# Altium project MainPCBV6.PrjPcb
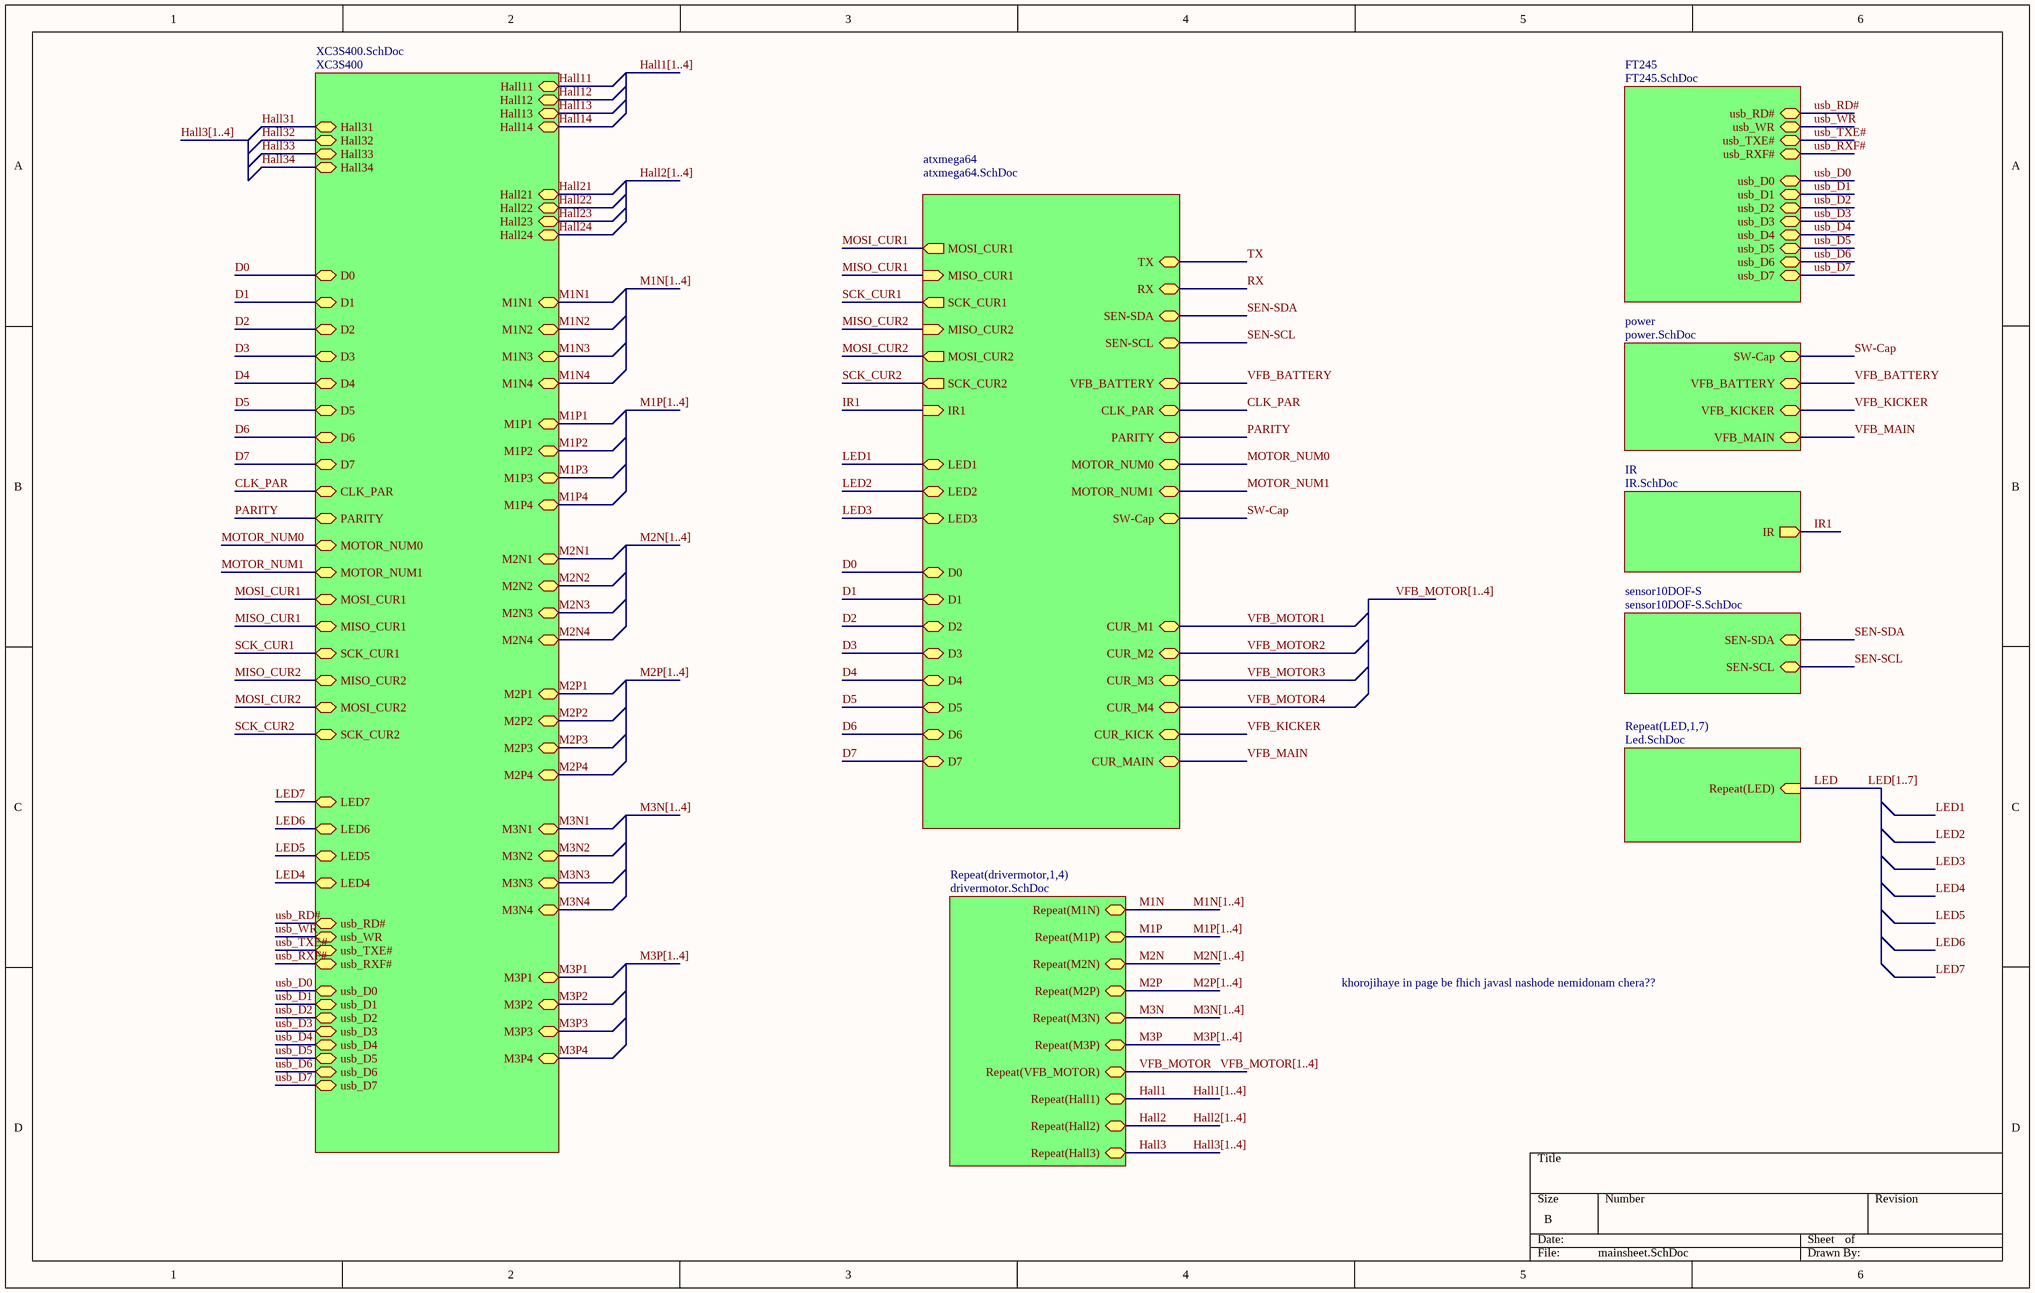
[diagram p0: mainsheet.SchDoc]
6 sheets, 150 parts. Net scope: hierarchical (ports join the sheet entries above them; power ports are global).
Board file: MainPCBV6.PcbDoc
Sheets:
  mainsheet.SchDoc
    atxmega64 = atxmega64.SchDoc
    power = power.SchDoc
    IR = IR.SchDoc
    sensor10DOF-S = sensor10DOF-S.SchDoc
    drivermotor1 = drivermotor.SchDoc
    drivermotor2 = drivermotor.SchDoc
    drivermotor3 = drivermotor.SchDoc
    drivermotor4 = drivermotor.SchDoc

## Sheet mainsheet.SchDoc
size B

### Sub-sheets
atxmega64 = atxmega64.SchDoc: MOSI_CUR1 (out), MISO_CUR1 (in), SCK_CUR1 (out), MISO_CUR2 (in), MOSI_CUR2 (out), SCK_CUR2 (out), IR1 (in), LED1, LED2, LED3, D0, D1, D2, D3, D4, D5, D6, D7, TX, RX, SEN-SDA, SEN-SCL, CLK_PAR, PARITY, MOTOR_NUM0, MOTOR_NUM1, CUR_M1, CUR_M2, CUR_M3, CUR_M4, CUR_KICK, CUR_MAIN, VFB_BATTERY, SW-Cap
FT245 = FT245.SchDoc (file not in this document): usb_RD#, usb_WR, usb_TXE#, usb_RXF#, usb_D0, usb_D1, usb_D2, usb_D3, usb_D4, usb_D5, usb_D6, usb_D7
IR = IR.SchDoc: IR (out)
power = power.SchDoc: SW-Cap, VFB_BATTERY, VFB_KICKER, VFB_MAIN
Repeat(drivermotor,1,4) = drivermotor.SchDoc: Repeat(M1N), Repeat(M1P), Repeat(M2N), Repeat(M2P), Repeat(M3N), Repeat(M3P), Repeat(VFB_MOTOR), Repeat(Hall1), Repeat(Hall2), Repeat(Hall3)
Repeat(LED,1,7) = Led.SchDoc (file not in this document): Repeat(LED) (in)
sensor10DOF-S = sensor10DOF-S.SchDoc: SEN-SDA, SEN-SCL
XC3S400 = XC3S400.SchDoc (file not in this document): D1, D2, D3, D0, D4, D5, D6, D7, MOSI_CUR1, MISO_CUR1, SCK_CUR1, MISO_CUR2, MOSI_CUR2, M1N1, M1N2, M1N3, M1N4, M1P1, M1P2, M1P3, M1P4, M2N1, M2N2, M2N3, M2N4, M2P1, M2P2, M2P3, M2P4, SCK_CUR2, Hall11, Hall12, Hall13, Hall14, Hall33, Hall34, Hall32, Hall31, Hall21, Hall22, Hall23, Hall24, M3N1, M3N2, M3N3, M3N4, M3P1, M3P2, M3P3, M3P4, LED7, LED6, LED5, LED4, CLK_PAR, PARITY, MOTOR_NUM0, MOTOR_NUM1, usb_RD#, usb_WR, usb_TXE#, usb_RXF#, usb_D0, usb_D1, usb_D2, usb_D3, usb_D4, usb_D5, usb_D6, usb_D7

### Nets
CLK_PAR: sheet XC3S400/CLK_PAR, sheet atxmega64/CLK_PAR
D0: sheet XC3S400/D0, sheet atxmega64/D0
D1: sheet XC3S400/D1, sheet atxmega64/D1
D2: sheet XC3S400/D2, sheet atxmega64/D2
D3: sheet XC3S400/D3, sheet atxmega64/D3
D4: sheet XC3S400/D4, sheet atxmega64/D4
D5: sheet XC3S400/D5, sheet atxmega64/D5
D6: sheet XC3S400/D6, sheet atxmega64/D6
D7: sheet XC3S400/D7, sheet atxmega64/D7
Hall1: sheet Repeat(drivermotor,1,4)/Repeat(Hall1)
Hall2: sheet Repeat(drivermotor,1,4)/Repeat(Hall2)
Hall3: sheet Repeat(drivermotor,1,4)/Repeat(Hall3)
IR1: sheet atxmega64/IR1, sheet IR/IR
LED: sheet Repeat(LED,1,7)/Repeat(LED)
LED1: sheet atxmega64/LED1, sheet atxmega64/RX  [also labelled RX]
LED4: sheet XC3S400/LED4
LED5: sheet XC3S400/LED5
LED6: sheet XC3S400/LED6
LED7: sheet XC3S400/LED7
M1N: sheet Repeat(drivermotor,1,4)/Repeat(M1N)
M1P: sheet Repeat(drivermotor,1,4)/Repeat(M1P)
M2N: sheet Repeat(drivermotor,1,4)/Repeat(M2N)
M2P: sheet Repeat(drivermotor,1,4)/Repeat(M2P)
M3N: sheet Repeat(drivermotor,1,4)/Repeat(M3N)
M3P: sheet Repeat(drivermotor,1,4)/Repeat(M3P)
MISO_CUR1: sheet XC3S400/MISO_CUR1, sheet atxmega64/MISO_CUR1
MISO_CUR2: sheet XC3S400/MISO_CUR2, sheet atxmega64/MISO_CUR2
MOSI_CUR1: sheet XC3S400/MOSI_CUR1, sheet atxmega64/MOSI_CUR1
MOSI_CUR2: sheet XC3S400/MOSI_CUR2, sheet atxmega64/MOSI_CUR2
MOTOR_NUM0: sheet XC3S400/MOTOR_NUM0, sheet atxmega64/MOTOR_NUM0
MOTOR_NUM1: sheet XC3S400/MOTOR_NUM1, sheet atxmega64/MOTOR_NUM1
PARITY: sheet XC3S400/PARITY, sheet atxmega64/PARITY
SCK_CUR1: sheet XC3S400/SCK_CUR1, sheet atxmega64/SCK_CUR1
SCK_CUR2: sheet XC3S400/SCK_CUR2, sheet atxmega64/SCK_CUR2
SEN-SCL: sheet atxmega64/SEN-SCL, sheet sensor10DOF-S/SEN-SCL
SEN-SDA: sheet atxmega64/SEN-SDA, sheet sensor10DOF-S/SEN-SDA
SW-Cap: sheet atxmega64/SW-Cap, sheet power/SW-Cap
usb_D0: sheet XC3S400/usb_D0, sheet FT245/usb_D0
usb_D1: sheet XC3S400/usb_D1, sheet FT245/usb_D1
usb_D2: sheet XC3S400/usb_D2, sheet FT245/usb_D2
usb_D3: sheet XC3S400/usb_D3, sheet FT245/usb_D3
usb_D4: sheet XC3S400/usb_D4, sheet FT245/usb_D4
usb_D5: sheet XC3S400/usb_D5, sheet FT245/usb_D5
usb_D6: sheet XC3S400/usb_D6, sheet FT245/usb_D6
usb_D7: sheet XC3S400/usb_D7, sheet FT245/usb_D7
usb_RD#: sheet XC3S400/usb_RD#, sheet FT245/usb_RD#
usb_RXF#: sheet XC3S400/usb_RXF#, sheet FT245/usb_RXF#
usb_TXE#: sheet XC3S400/usb_TXE#, sheet FT245/usb_TXE#
usb_WR: sheet XC3S400/usb_WR, sheet FT245/usb_WR
VFB_BATTERY: sheet atxmega64/VFB_BATTERY, sheet power/VFB_BATTERY
VFB_KICKER: sheet atxmega64/CUR_KICK, sheet power/VFB_KICKER  [project net CUR_KICK]
VFB_MAIN: sheet atxmega64/CUR_MAIN, sheet power/VFB_MAIN  [project net CUR_MAIN]
VFB_MOTOR: sheet Repeat(drivermotor,1,4)/Repeat(VFB_MOTOR)

### Buses and harness runs
bus Hall1[1..4]
bus Hall2[1..4]
bus Hall3[1..4]
bus LED[1..7]
bus M1N[1..4]
bus M1P[1..4]
bus M2N[1..4]
bus M2P[1..4]
bus M3N[1..4]
bus M3P[1..4]
bus VFB_MOTOR[1..4]

### Notes on the sheet
- khorojihaye in page be fhich javasl nashode nemidonam chera??

## Sheet atxmega64.SchDoc
size B
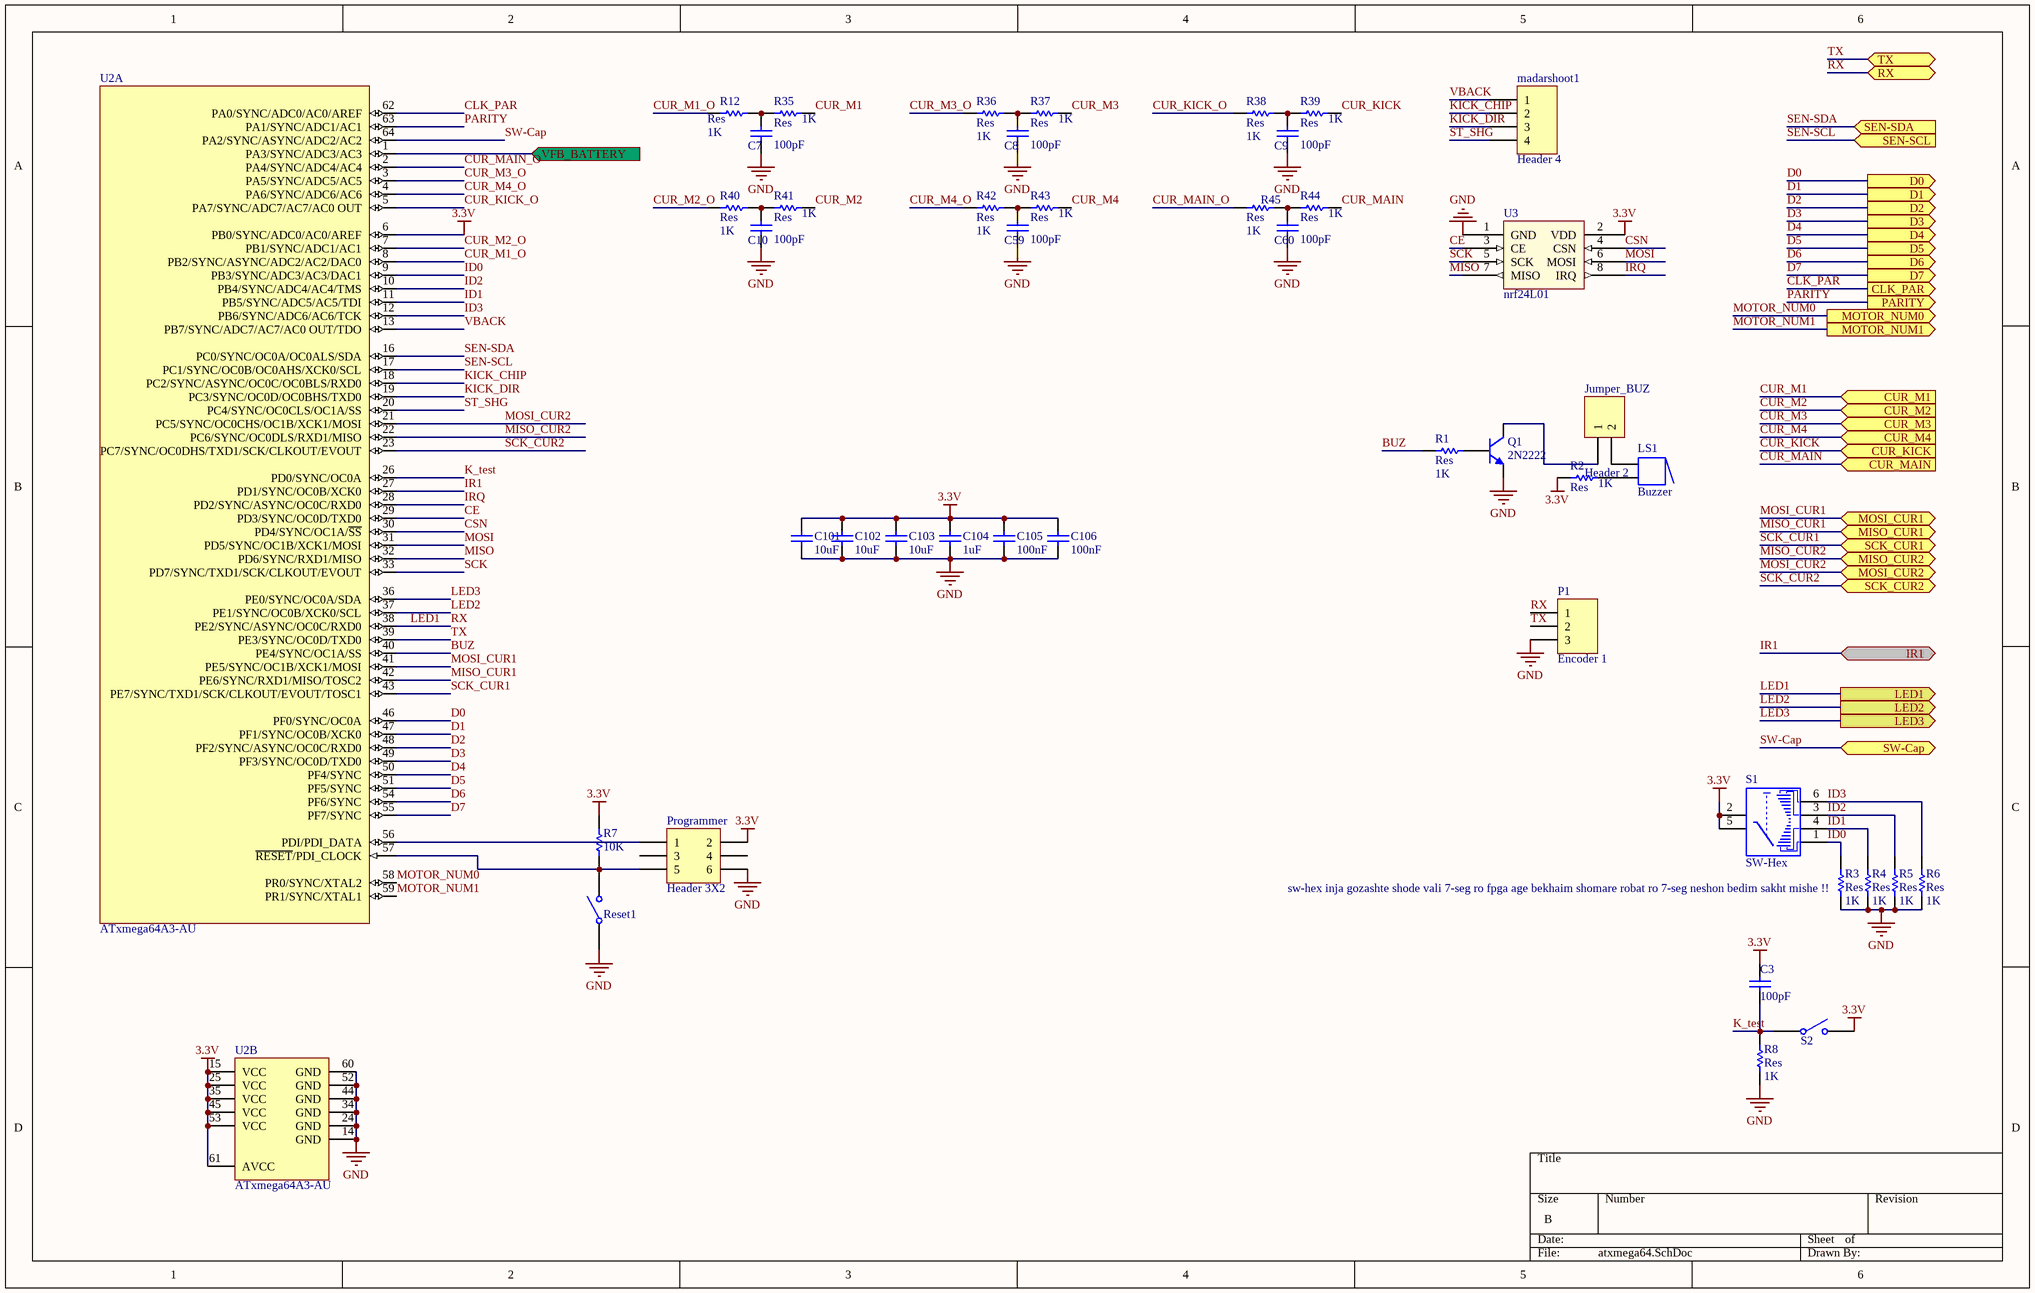
[diagram p1: atxmega64.SchDoc]

### Parts
C3  value 100pF  [2012[0805]]  (hidden comment: Cap_UP)
C7  value 100pF  [2012[0805]]  (hidden comment: Cap_UP)
C8  value 100pF  [2012[0805]]  (hidden comment: Cap_UP)
C9  value 100pF  [2012[0805]]  (hidden comment: Cap_UP)
C10  value 100pF  [2012[0805]]  (hidden comment: Cap_UP)
C59  value 100pF  [2012[0805]]  (hidden comment: Cap_UP)
C60  value 100pF  [2012[0805]]  (hidden comment: Cap_UP)
C101  value 10uF  [2012[0805]]  (hidden comment: Cap_UP)
C102  value 10uF  [2012[0805]]  (hidden comment: Cap_UP)
C103  value 10uF  [2012[0805]]  (hidden comment: Cap_UP)
C104  value 1uF  [2012[0805]]  (hidden comment: Cap_UP)
C105  value 100nF  [2012[0805]]  (hidden comment: Cap_UP)
C106  value 100nF  [2012[0805]]  (hidden comment: Cap_UP)
Jumper_BUZ  Header 2  [HDR1X2]
LS1  Buzzer  [BUZZER]
madarshoot1  Header 4  [sucket-smd-4pin]
P1  Encoder 1  [HDR1X3A]
Programmer  Header 3X2  [HDRBOX2X3]
Q1  2N2222  [SOT-23]
R1  Res  value 1K  [2012[0805]]
R2  Res  value 1K  [2012[0805]]
R3  Res  value 1K  [2012[0805]]
R4  Res  value 1K  [2012[0805]]
R5  Res  value 1K  [2012[0805]]
R6  Res  value 1K  [2012[0805]]
R7  10K  [2012[0805]]
R8  Res  value 1K  [2012[0805]]
R12  Res  value 1K  [2012[0805]]
R35  Res  value 1K  [2012[0805]]
R36  Res  value 1K  [2012[0805]]
R37  Res  value 1K  [2012[0805]]
R38  Res  value 1K  [2012[0805]]
R39  Res  value 1K  [2012[0805]]
R40  Res  value 1K  [2012[0805]]
R41  Res  value 1K  [2012[0805]]
R42  Res  value 1K  [2012[0805]]
R43  Res  value 1K  [2012[0805]]
R44  Res  value 1K  [2012[0805]]
R45  Res  value 1K  [2012[0805]]
Reset1  SW-SPST  [PUSH-BUT]  (value not drawn)
S1  SW-Hex  [SW-HEX]
S2  SW-SPST  [PUSH-BUT]  (value not drawn)
U2  ATxmega64A3-AU  [64A_N]  (parts A,B of 2)
U3  nrf24L01  [NRF24L01]

### Ports
CLK_PAR (out), CUR_KICK (in), CUR_M1 (in), CUR_M2 (in), CUR_M3 (in), CUR_M4 (in), CUR_MAIN (in), D0 (out), D1 (out), D2 (out), D3 (out), D4 (out), D5 (out), D6 (out), D7 (out), IR1, LED1 (out), LED2 (out), LED3 (out), MISO_CUR1, MISO_CUR2, MOSI_CUR1, MOSI_CUR2, MOTOR_NUM0 (out), MOTOR_NUM1 (out), PARITY (out), RX, SCK_CUR1, SCK_CUR2, SEN-SCL (in), SEN-SDA (in), SW-Cap, TX, VFB_BATTERY (in)

### Nets
3.3V: C3.2 C101.2 C102.2 C103.2 C104.2 C105.2 C106.2 Programmer.2 R2.1 R7.1 S1.2 S1.5 S2.2(NO) U2.6(PB0/SYNC/ADC0/AC0/AREF) U2.15(VCC) U2.25(VCC) U2.35(VCC) U2.45(VCC) U2.53(VCC) U2.61(AVCC) U3.2(VDD)
GND: C7.1 C8.1 C9.1 C10.1 C59.1 C60.1 C101.1 C102.1 C103.1 C104.1 C105.1 C106.1 P1.3 Programmer.6 Q1.3(E) R3.1 R4.1 R5.1 R6.1 R8.2 Reset1.1(COMMON) U2.14(GND) U2.24(GND) U2.34(GND) U2.44(GND) U2.52(GND) U2.60(GND) U3.1(GND)
BUZ: R1.1 U2.40(PE4/SYNC/OC1A/SS)
CE: U2.29(PD3/SYNC/OC0D/TXD0) U3.3(CE)
CLK_PAR: U2.62(PA0/SYNC/ADC0/AC0/AREF) ; port CLK_PAR
CSN: U2.30(PD4/SYNC/OC1A/~{SS}) U3.4(CSN)
CUR_KICK: R39.2 ; port CUR_KICK
CUR_KICK_O: R38.1 U2.5(PA7/SYNC/ADC7/AC7/AC0_OUT)
CUR_M1: R35.2 ; port CUR_M1
CUR_M1_O: R12.1 U2.8(PB2/SYNC/ASYNC/ADC2/AC2/DAC0)
CUR_M2: R41.2 ; port CUR_M2
CUR_M2_O: R40.1 U2.7(PB1/SYNC/ADC1/AC1)
CUR_M3: R37.2 ; port CUR_M3
CUR_M3_O: R36.1 U2.3(PA5/SYNC/ADC5/AC5)
CUR_M4: R43.2 ; port CUR_M4
CUR_M4_O: R42.1 U2.4(PA6/SYNC/ADC6/AC6)
CUR_MAIN: R44.2 ; port CUR_MAIN
CUR_MAIN_O: R45.1 U2.2(PA4/SYNC/ADC4/AC4)
D0: U2.46(PF0/SYNC/OC0A) ; port D0
D1: U2.47(PF1/SYNC/OC0B/XCK0) ; port D1
D2: U2.48(PF2/SYNC/ASYNC/OC0C/RXD0) ; port D2
D3: U2.49(PF3/SYNC/OC0D/TXD0) ; port D3
D4: U2.50(PF4/SYNC) ; port D4
D5: U2.51(PF5/SYNC) ; port D5
D6: U2.54(PF6/SYNC) ; port D6
D7: U2.55(PF7/SYNC) ; port D7
ID0: R3.2 S1.1 U2.9(PB3/SYNC/ADC3/AC3/DAC1)
ID1: R4.2 S1.4 U2.11(PB5/SYNC/ADC5/AC5/TDI)
ID2: R5.2 S1.3 U2.10(PB4/SYNC/ADC4/AC4/TMS)
ID3: R6.2 S1.6 U2.12(PB6/SYNC/ADC6/AC6/TCK)
IR1: U2.27(PD1/SYNC/OC0B/XCK0) ; port IR1
IRQ: U2.28(PD2/SYNC/ASYNC/OC0C/RXD0) U3.8(IRQ)
K_test: C3.1 R8.1 S2.1(COMMON) U2.26(PD0/SYNC/OC0A)
KICK_CHIP: madarshoot1.2 U2.18(PC2/SYNC/ASYNC/OC0C/OC0BLS/RXD0)
KICK_DIR: madarshoot1.3 U2.19(PC3/SYNC/OC0D/OC0BHS/TXD0)
LED1: P1.1 U2.38(PE2/SYNC/ASYNC/OC0C/RXD0) ; port LED1, port RX  [also labelled RX]
LED2: U2.37(PE1/SYNC/OC0B/XCK0/SCL) ; port LED2
LED3: U2.36(PE0/SYNC/OC0A/SDA) ; port LED3
MISO: U2.32(PD6/SYNC/RXD1/MISO) U3.7(MISO)
MISO_CUR1: U2.42(PE6/SYNC/RXD1/MISO/TOSC2) ; port MISO_CUR1
MISO_CUR2: U2.22(PC6/SYNC/OC0DLS/RXD1/MISO) ; port MISO_CUR2
MOSI: U2.31(PD5/SYNC/OC1B/XCK1/MOSI) U3.6(MOSI)
MOSI_CUR1: U2.41(PE5/SYNC/OC1B/XCK1/MOSI) ; port MOSI_CUR1
MOSI_CUR2: U2.21(PC5/SYNC/OC0CHS/OC1B/XCK1/MOSI) ; port MOSI_CUR2
MOTOR_NUM0: U2.58(PR0/SYNC/XTAL2) ; port MOTOR_NUM0
MOTOR_NUM1: U2.59(PR1/SYNC/XTAL1) ; port MOTOR_NUM1
PARITY: U2.63(PA1/SYNC/ADC1/AC1) ; port PARITY
SCK: U2.33(PD7/SYNC/TXD1/SCK/CLKOUT/EVOUT) U3.5(SCK)
SCK_CUR1: U2.43(PE7/SYNC/TXD1/SCK/CLKOUT/EVOUT/TOSC1) ; port SCK_CUR1
SCK_CUR2: U2.23(PC7/SYNC/OC0DHS/TXD1/SCK/CLKOUT/EVOUT) ; port SCK_CUR2
SEN-SCL: U2.17(PC1/SYNC/OC0B/OC0AHS/XCK0/SCL) ; port SEN-SCL
SEN-SDA: U2.16(PC0/SYNC/OC0A/OC0ALS/SDA) ; port SEN-SDA
ST_SHG: madarshoot1.4 U2.20(PC4/SYNC/OC0CLS/OC1A/SS)
SW-Cap: U2.64(PA2/SYNC/ASYNC/ADC2/AC2) ; port SW-Cap
TX: P1.2 U2.39(PE3/SYNC/OC0D/TXD0) ; port TX
VBACK: madarshoot1.1 U2.13(PB7/SYNC/ADC7/AC7/AC0_OUT/TDO)
VFB_BATTERY: U2.1(PA3/SYNC/ADC3/AC3) ; port VFB_BATTERY
NetC7_2: C7.2 R12.2 R35.1
NetC8_2: C8.2 R36.2 R37.1
NetC9_2: C9.2 R38.2 R39.1
NetC10_2: C10.2 R40.2 R41.1
NetC59_2: C59.2 R42.2 R43.1
NetC60_2: C60.2 R44.1 R45.2
NetJumper_BUZ_1: Jumper_BUZ.1 Q1.1(C)
NetJumper_BUZ_2: Jumper_BUZ.2 LS1.1
NetLS1_2: LS1.2 R2.2
NetProgrammer_1: Programmer.1 U2.56(PDI/PDI_DATA)
NetProgrammer_5: Programmer.5 R7.2 Reset1.2(NO) U2.57(~{RESET}/PDI_CLOCK)
NetQ1_2: Q1.2(B) R1.2

Not connected (* = marked no-connect by the designer): Programmer 3 4

### Notes on the sheet
- sw-hex inja gozashte shode vali 7-seg ro fpga age bekhaim shomare robat ro 7-seg neshon bedim sakht mishe !!

### Library data of the parts
C3 C7-C10 C59 C60 C101-C106 = Cap_UP: Capacitor; Published: 8-Jun-2000; LatestRevisionDate: 17-Jul-2002; LatestRevisionNote: Re-released for DXP Platform.; PackageReference: RAD-0.3; Publisher: Altium Limited
Jumper_BUZ = Header 2: Header, 2-Pin; LatestRevisionDate: 17-Jul-2002; LatestRevisionNote: Re-released for DXP Platform.; Publisher: Altium Limited
LS1 = Buzzer: Magnetic Transducer Buzzer; Published: 24-Mar-1999; LatestRevisionDate: 17-Dec-2003; LatestRevisionNote: Schematic revised, PCB Footprint replaced.; DatasheetDocument: 17-Dec-2003; PackageReference: ABSM-1574; Publisher: Altium Limited; ComponentLink1Description: Manufacturer Link; ComponentLink1URL: http://www.megastar.com/linecard/buzzmode/index.php
madarshoot1 = Header 4: Header, 4-Pin; LatestRevisionDate: 17-Jul-2002; LatestRevisionNote: Re-released for DXP Platform.; Publisher: Altium Limited
P1 = Header 3: Header, 3-Pin; LatestRevisionDate: 17-Jul-2002; LatestRevisionNote: Re-released for DXP Platform.; Publisher: Altium Limited
Programmer = Header 3X2: Header, 3-Pin, Dual row; LatestRevisionDate: 17-Jul-2002; LatestRevisionNote: Re-released for DXP Platform.; Publisher: Altium Limited
Q1 = 2N2222: NPN Bipolar Transistor; Published: 8-Jun-2000; LatestRevisionDate: 17-Jul-2002; LatestRevisionNote: Re-released for DXP Platform.; PackageReference: TO-226; Publisher: Altium Limited; Code_JEDEC: TO-226-AA
R1-R8 R12 R35-R45 = Res: Semiconductor Resistor; Published: 8-Jun-2000; LatestRevisionDate: 17-Jul-2002; LatestRevisionNote: Re-released for DXP Platform.; PackageReference: AXIAL-0.5; Publisher: Altium Limited
Reset1 S2 = SW-SPST: Single-Pole, Single-Throw Switch; Published: 24-Mar-1999; Revision: July-2002: Re-released for DXP Platform.; Publisher: Altium Limited
U2 = ATxmega64A3-AU: 8/16-bit AVR XMEGA A3 Microcontroller, 1.6-3.6V, 64KB + 4KB Flash, 2KB EEPROM, 4KB SRAM, 64-pin TQFP, Industrial Grade (-40°C to 85°C), Pb-Free; Published: 1-Apr-2010; DatasheetVersion: revQ, Feb-2010; PackageVersion: revB, Oct-2001; PackageReference: 64A; Publisher: Altium Limited; PackageDescription: 64-Pin Plastic Thin Profile Quad Flat Pack, 14 x 14 x 1.0 mm Body, 0.8 mm Pitch (TQFP); Supplier 1: Digi-Key; Supplier Part Number 1: ATXMEGA64A3-AU-ND; Supplier 2: Farnell; Supplier Part Number 2: 1748559; Supplier 3: Mouser; Supplier Part Number 3: 556-ATXMEGA64A3-AU; Code_JEDEC: MS-026-AEB; ComponentLink1Description: Manufacturer Link; ComponentLink1URL: http://www.atmel.com/products/avr/default.asp?; ComponentLink2Description: ATxmega64A3/128A3/192A3/256A3 Datasheet; ComponentLink2URL: http://www.atmel.com/dyn/resources/prod_documents/doc8068.pdf; ComponentLink3Description: Atmel.com Home; ComponentLink3URL: http://www.atmel.com
S1 = SW-Hex: Published: 24-Mar-1999; LatestRevisionDate: 17-Jul-2002; LatestRevisionNote: Re-released for DXP Platform.; PackageReference: DIP-8; Publisher: Altium Limited

## Sheet power.SchDoc
size A
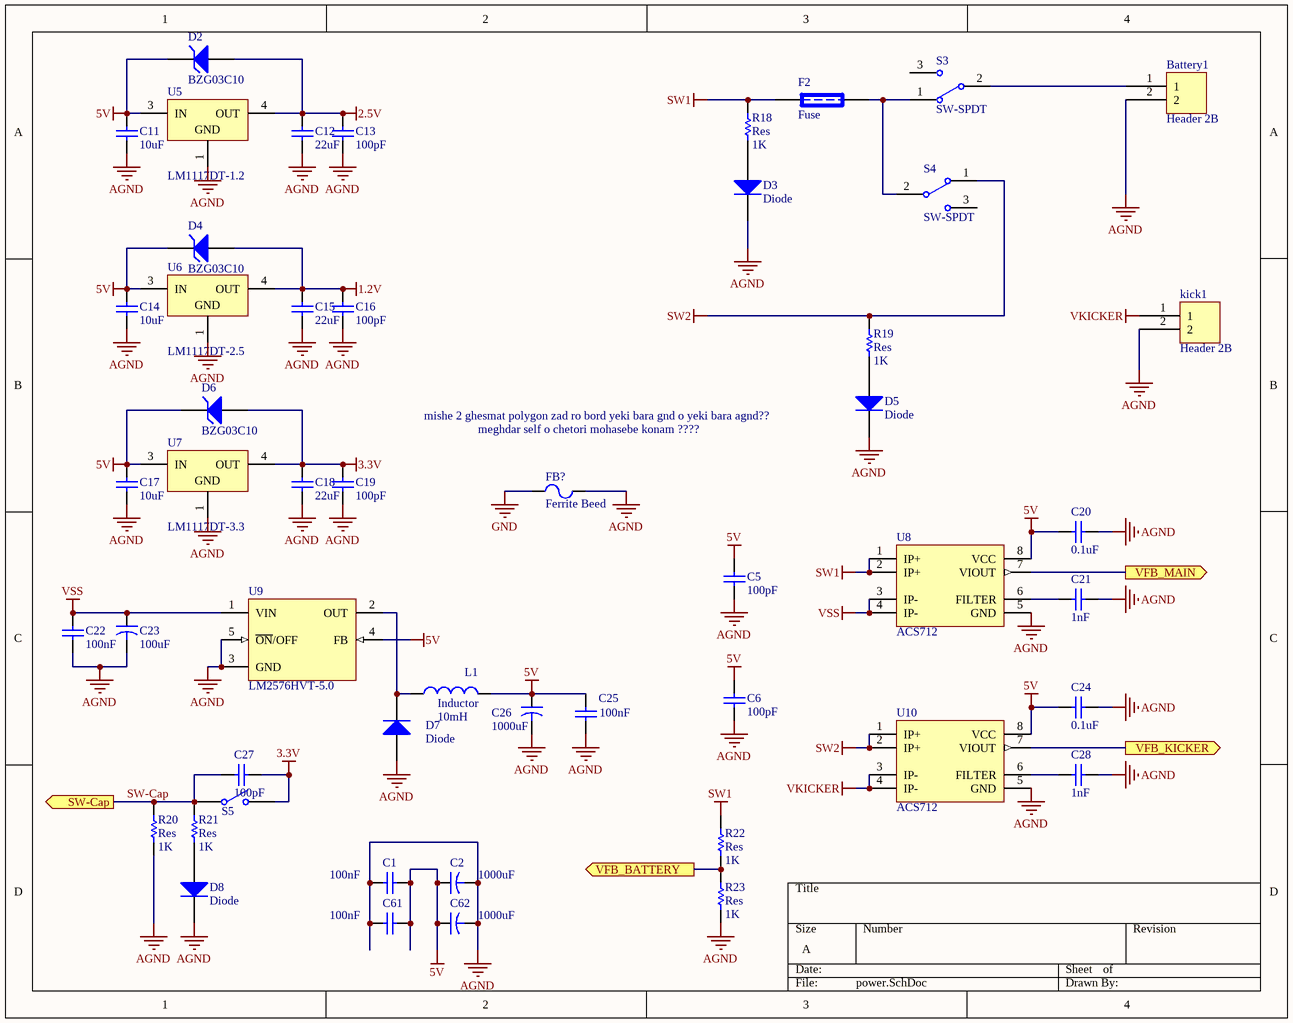
[diagram p2: power.SchDoc]

### Parts
Battery1  Header 2B  [BHDR1X2]
C1  value 100nF  [2012[0805]]  (hidden comment: Cap_UP)
C2  value 1000uF  [7343]  (hidden comment: Cap_El)
C5  value 100pF  [2012[0805]]  (hidden comment: Cap_UP)
C6  value 100pF  [2012[0805]]  (hidden comment: Cap_UP)
C11  value 10uF  [2012[0805]]  (hidden comment: Cap_UP)
C12  value 22uF  [2012[0805]]  (hidden comment: Cap_UP)
C13  value 100pF  [2012[0805]]  (hidden comment: Cap_UP)
C14  value 10uF  [2012[0805]]  (hidden comment: Cap_UP)
C15  value 22uF  [2012[0805]]  (hidden comment: Cap_UP)
C16  value 100pF  [2012[0805]]  (hidden comment: Cap_UP)
C17  value 10uF  [2012[0805]]  (hidden comment: Cap_UP)
C18  value 22uF  [2012[0805]]  (hidden comment: Cap_UP)
C19  value 100pF  [2012[0805]]  (hidden comment: Cap_UP)
C20  value 0.1uF  [2012[0805]]  (hidden comment: Cap_UP)
C21  value 1nF  [2012[0805]]  (hidden comment: Cap_UP)
C22  value 100nF  [2012[0805]]  (hidden comment: Cap_UP)
C23  value 100uF  [Cap1000u-16]  (hidden comment: Cap_El)
C24  value 0.1uF  [2012[0805]]  (hidden comment: Cap_UP)
C25  value 100nF  [2012[0805]]  (hidden comment: Cap_UP)
C26  value 1000uF  [7343]  (hidden comment: Cap_El)
C27  value 100pF  [2012[0805]]  (hidden comment: Cap_UP)
C28  value 1nF  [2012[0805]]  (hidden comment: Cap_UP)
C61  value 100nF  [2012[0805]]  (hidden comment: Cap_UP)
C62  value 1000uF  [7343]  (hidden comment: Cap_El)
D2  BZG03C10  [DO214]
D3  Diode  [2012[0805]]
D4  BZG03C10  [DO214]
D5  Diode  [2012[0805]]
D6  BZG03C10  [DO214]
D7  Diode  [US1M]
D8  Diode  [2012[0805]]
F2  Fuse  [fuse kh]
FB?  Ferrite Beed  [7343]
kick1  Header 2B  [BHDR1X2]
L1  Inductor  value 10mH  [inductor]
R18  Res  value 1K  [2012[0805]]
R19  Res  value 1K  [2012[0805]]
R20  Res  value 1K  [2012[0805]]
R21  Res  value 1K  [2012[0805]]
R22  Res  value 1K  [2012[0805]]
R23  Res  value 1K  [2012[0805]]
S3  SW-SPDT  [KEYKHRAB]
S4  SW-SPDT  [KEYKHRAB]
S5  SW-SPST  [push button B]  (value not drawn)
U5  LM1117DT-1.2  [SOT223]
U6  LM1117DT-2.5  [SOT223]
U7  LM1117DT-3.3  [SOT223]
U8  ACS712  [8 pin SOIC_N]
U9  LM2576HVT-5.0  [T05A]
U10  ACS712  [8 pin SOIC_N]

### Ports
SW-Cap (out), VFB_BATTERY (out), VFB_KICKER (out), VFB_MAIN (out)

### Nets
1.2V: C15.2 C16.2 D4.1(A) U6.4(OUT)
2.5V: C12.2 C13.2 D2.1(A) U5.4(OUT)
3.3V: C18.2 C19.2 C27.2 D6.1(A) S5.2(NO) U7.4(OUT)
5V: C1.2 C2.1 C5.2 C6.2 C11.2 C14.2 C17.2 C20.1 C24.1 C25.2 C26.1 C61.2 C62.1 D2.2(K) D4.2(K) D6.2(K) L1.2 U5.3(IN) U6.3(IN) U7.3(IN) U8.8(VCC) U9.4(FB) U10.8(VCC)
AGND: Battery1.2 C1.1 C2.2 C5.1 C6.1 C11.1 C12.1 C13.1 C14.1 C15.1 C16.1 C17.1 C18.1 C19.1 C20.2 C21.2 C22.1 C23.2 C24.2 C25.1 C26.2 C28.2 C61.1 C62.2 D3.2(K) D5.2(K) D7.1(A) D8.2(K) FB?.2 kick1.2 R20.1 R23.1 U5.1(GND) U6.1(GND) U7.1(GND) U8.5(GND) U9.3(GND) U9.5(~{ON}/OFF) U10.5(GND)
GND: FB?.1
SW1: F2.1 R18.2 R22.2 U8.1(IP+) U8.2(IP+)
SW2: R19.2 S4.1 U10.1(IP+) U10.2(IP+)
VKICKER: kick1.1 U10.3(IP-) U10.4(IP-)
VSS: C22.2 C23.1 U8.3(IP-) U8.4(IP-) U9.1(VIN)
CUR_KICK: U10.7(VIOUT) ; port VFB_KICKER
CUR_MAIN: U8.7(VIOUT) ; port VFB_MAIN
SW-Cap: C27.1 R20.2 R21.2 S5.1(COMMON) ; port SW-Cap
VFB_BATTERY: R22.1 R23.2 ; port VFB_BATTERY
NetBattery1_1: Battery1.1 S3.2
NetC21_1: C21.1 U8.6(FILTER)
NetC28_1: C28.1 U10.6(FILTER)
NetD3_1: D3.1(A) R18.1
NetD5_1: D5.1(A) R19.1
NetD7_2: D7.2(K) L1.1 U9.2(OUT)
NetD8_1: D8.1(A) R21.1
NetF2_2: F2.2 S3.1 S4.2

Not connected (* = marked no-connect by the designer): S3 3(1); S4 3(1)

### Notes on the sheet
- (near D5) mishe 2 ghesmat polygon zad ro bord yeki bara gnd o yeki bara agnd??
- meghdar self o chetori mohasebe konam ????

### Library data of the parts
C1 C5 C6 C11-C22 C24 C25 C27 C28 C61 = Cap_UP: Capacitor; Published: 8-Jun-2000; LatestRevisionDate: 17-Jul-2002; LatestRevisionNote: Re-released for DXP Platform.; PackageReference: RAD-0.3; Publisher: Altium Limited
C2 C23 C26 C62 = Cap_El: Capacitor; Published: 23-Sep-2002; PackageReference: CAPR5-4X5; Publisher: Altium Limited
D2 D4 D6 = BZG03C10: Silicon Zener Diode (3W); Published: 8-Jun-2000; LatestRevisionDate: 17-Jul-2002; LatestRevisionNote: Re-released for DXP Platform.; DatasheetDocument: 1-Apr-1999; PackageDocument: Apr-1999; PackageReference: DO214; Publisher: Altium Limited; ComponentLink1Description: Manufacturer Link; ComponentLink1URL: http://www.vishay.com/; ComponentLink2Description: Datasheet; ComponentLink2URL: http://www.vishay.com/docs/85593/85593.pdf
D3 D5 D7 D8 = Diode: 1 Amp General Purpose Rectifier; Revision 1: 11-Jul-2000: SIM Model Added.; Revision 2: 17-Jul-2002: Re-released for DXP Platform.; Package Information: Latest Revision: Aug-1999; Code - JEDEC: DO-204-AL; Published: 8-Jun-2000; Datasheet: Latest Revision: 1998; Package Reference: DO-41; Publisher: Altium Limited
FB? = Ferrite Beed: Code_IEC: 1005; Published: 8-Jun-2000; LatestRevisionDate: 17-Jul-2002; LatestRevisionNote: Re-released for DXP Platform.; PackageReference: 0402-A; Publisher: Altium Limited; Code_JEITA: 0402
L1 = Inductor: Code_IEC: 1005; Published: 8-Jun-2000; LatestRevisionDate: 17-Jul-2002; LatestRevisionNote: Re-released for DXP Platform.; PackageReference: 0402-A; Publisher: Altium Limited; Code_JEITA: 0402
R18-R23 = Res: Semiconductor Resistor; Published: 8-Jun-2000; LatestRevisionDate: 17-Jul-2002; LatestRevisionNote: Re-released for DXP Platform.; PackageReference: AXIAL-0.5; Publisher: Altium Limited
S3 S4 = SW-SPDT: SPDT Subminiature Toggle Switch, Right Angle Mounting, Vertical Actuation; Published: 24-Mar-1999; LatestRevisionDate: 17-Dec-2003; LatestRevisionNote: Schematic revised, PCB Footprint replaced.; DatasheetDocument: 05-Dec-2000; PackageReference: TL36WW15050; Publisher: Altium Limited; ComponentLink1Description: Manufacturer Link; ComponentLink1URL: http://www.apem.com
S5 = SW-SPST: Single-Pole, Single-Throw Switch; Published: 24-Mar-1999; Revision: July-2002: Re-released for DXP Platform.; Publisher: Altium Limited
U5-U7 = LM1117DT-3.3: 800mA Low-Dropout Linear Regulator, 3-pin TO-252; Manufacturer: National Semiconductor; PackageTopMarking: NSUZXYTT*LM1117*DT-3.3; PowerWise: N; CompType: LDO IC; Published: 4-Dec-2008; DatasheetVersion: Apr-2006; PackageVersion: revD, Feb-2009; PackageReference: TD03B; Publisher: Altium Limited; PackageDescription: TO252, Molded, Jedec, 6.8 x 6.10 x 2.30mm Body, 3 Lead, 2.28mm Pitch, Surface Mount; Supplier 1: Farnell; Supplier Part Number 1: 9486275; Supplier 2: Farnell; Supplier Part Number 2: 1523829; PartNumber: LM1117DT-3.3; RoHS: N; PinCount: 3; Code_JEDEC: TO-252-AA; ComponentLink1Description: LM1117 Datasheet; ComponentLink1URL: http://www.national.com/ds/LM/LM1117.pdf; ComponentLink2Description: LM1117 Web Page; ComponentLink2URL: http://www.national.com/pf/LM/LM1117.html; ComponentLink3Description: TD03B Package Page; ComponentLink3URL: http://www.national.com/packaging/folders/td03b.html
U9 = LM2576HVT-5.0: SIMPLE SWITCHER; 3A Step-Down Voltage Regulator; Manufacturer: National Semiconductor; PackageTopMarking: NSUZXYTT*LM2576HVT*-5.0 P+; Published: 27-Nov-2008; DatasheetVersion: Aug-2004; PackageVersion: revJ, Jan-1992; PackageReference: T05A; Publisher: Altium Limited; PackageDescription: TO-220, Molded, 5 Lead, Straight; CompType: Switcher; PartNumber: LM2576HVT-5.0; RoHS: O; PinCount: 5; DigiKeyPartNumber: LM2576HVT-5.0-ND; Code_JEDEC: TO-220-AB; ComponentLink1Description: LM2576HV Datasheet; ComponentLink1URL: http://www.national.com/ds/LM/LM2576HV.pdf; ComponentLink2Description: LM2576HV Web Page; ComponentLink2URL: http://www.national.com/pf/LM/LM2576HV.html; ComponentLink3Description: T05A Package Page; ComponentLink3URL: http://www.national.com/packaging/folders/t05a.html
F2 = Fuse: Published: 8-Jun-2000; LatestRevisionDate: 17-Jul-2002; LatestRevisionNote: Re-released for DXP Platform.; PackageReference: PIN-W2/E2.8; Publisher: Altium Limited

## Sheet IR.SchDoc
size A
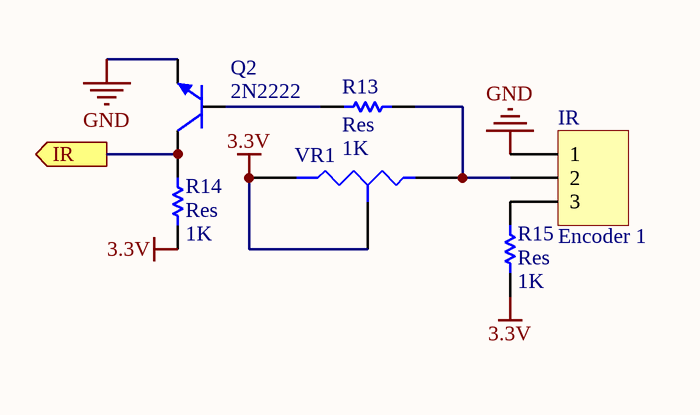
[diagram p3: IR.SchDoc]

### Parts
IR  Encoder 1  [HDR1X3]
Q2  2N2222  [SOT-23]
R13  Res  value 1K  [2012[0805]]
R14  Res  value 1K  [2012[0805]]
R15  Res  value 1K  [2012[0805]]
VR1  Res Tap  [MULTITURN]  (value not drawn)

### Ports
IR (out)

### Nets
3.3V: R14.1 R15.1 VR1.2(B) VR1.3(TAP)
GND: IR.1 Q2.3(E)
IR1: Q2.1(C) R14.2 ; port IR
NetIR_2: IR.2 R13.2 VR1.1(A)
NetIR_3: IR.3 R15.2
NetQ2_2: Q2.2(B) R13.1

### Library data of the parts
IR = Header 3: Header, 3-Pin; LatestRevisionDate: 17-Jul-2002; LatestRevisionNote: Re-released for DXP Platform.; Publisher: Altium Limited
Q2 = 2N2222: NPN Bipolar Transistor; Published: 8-Jun-2000; LatestRevisionDate: 17-Jul-2002; LatestRevisionNote: Re-released for DXP Platform.; PackageReference: TO-226; Publisher: Altium Limited; Code_JEDEC: TO-226-AA
R13-R15 = Res: Semiconductor Resistor; Published: 8-Jun-2000; LatestRevisionDate: 17-Jul-2002; LatestRevisionNote: Re-released for DXP Platform.; PackageReference: AXIAL-0.5; Publisher: Altium Limited
VR1 = Res Tap: Tapped Resistor; Sim Note: Enter the Resistance value and the set point into parameter fields.; Set Position: 0.5; Published: 24-Mar-1999; LatestRevisionDate: 17-Jul-2002; LatestRevisionNote: Re-released for DXP Platform.; PackageReference: VR3; Publisher: Altium Limited

## Sheet sensor10DOF-S.SchDoc
size A
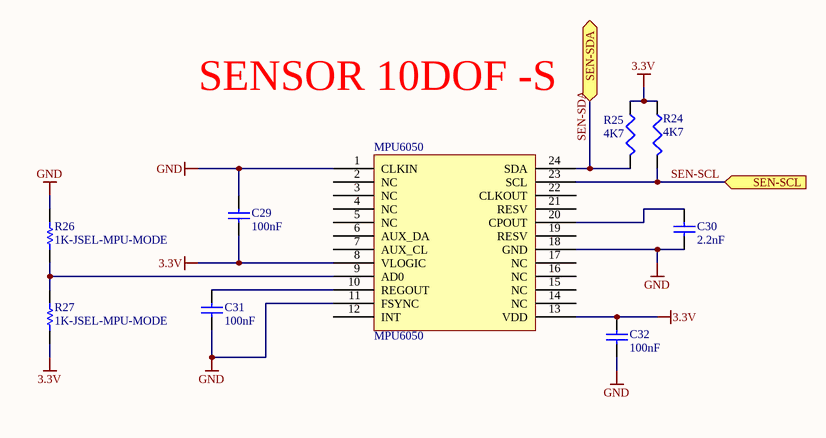
[diagram p4: sensor10DOF-S.SchDoc]

### Parts
C29  100nF  [2012[0805]]
C30  2.2nF  [2012[0805]]
C31  100nF  [2012[0805]]
C32  100nF  [2012[0805]]
MPU6050  MPU6050  [QFN_36]
R24  4K7  [2012[0805]]
R25  4K7  [2012[0805]]
R26  1K-JSEL-MPU-MODE  [2012[0805]]
R27  1K-JSEL-MPU-MODE  [2012[0805]]

### Ports
SEN-SCL (in), SEN-SDA

### Nets
3.3V: C29.1 C32.2 MPU6050.8(VLOGIC) MPU6050.13(VDD) R24.1 R25.1 R27.1
GND: C29.2 C30.1 C31.1 C32.1 MPU6050.1(CLKIN) MPU6050.11(FSYNC) MPU6050.18(GND) R26.2
SEN-SCL: MPU6050.23(SCL) R24.2 ; port SEN-SCL
SEN-SDA: MPU6050.24(SDA) R25.2 ; port SEN-SDA
NetC30_2: C30.2 MPU6050.20(CPOUT)
NetC31_2: C31.2 MPU6050.10(REGOUT)
NetMPU6050_9: MPU6050.9(AD0) R26.1 R27.2

Not connected (* = marked no-connect by the designer): MPU6050 2(NC) 3(NC) 4(NC) 5(NC) 6(AUX_DA) 7(AUX_CL) 12(INT) 14(NC) 15(NC) 16(NC) 17(NC) 19(RESV) 21(RESV) 22(CLKOUT)

### Notes on the sheet
- SENSOR 10DOF -S

### Library data of the parts
C29 C31 C32 = Cap: Capacitor; Published: 8-Jun-2000; LatestRevisionDate: 17-Jul-2002; LatestRevisionNote: Re-released for DXP Platform.; PackageReference: RAD-0.3; Publisher: Altium Limited; Value: 100nF
C30 = Cap: Capacitor; Value: 100nF; Published: 8-Jun-2000; LatestRevisionDate: 17-Jul-2002; LatestRevisionNote: Re-released for DXP Platform.; PackageReference: RAD-0.3; Publisher: Altium Limited
R24 R25 = Res3: Resistor; Value: 10K; Published: 8-Jun-2000; LatestRevisionDate: 04-Mar-2005; LatestRevisionNote: PCB Footprint replaced.; PackageReference: J1-0603; Publisher: Altium Limited
R26 R27 = Res1: Resistor; Value: 1K; Published: 8-Jun-2000; LatestRevisionDate: 17-Jul-2002; LatestRevisionNote: Re-released for DXP Platform.; PackageReference: AXIAL-0.3; Publisher: Altium Limited

## Sheet drivermotor.SchDoc
size A
Used 4 times, as channels drivermotor1, drivermotor2, drivermotor3, drivermotor4. Parts and nets are listed once, with the designators drawn on the sheet.
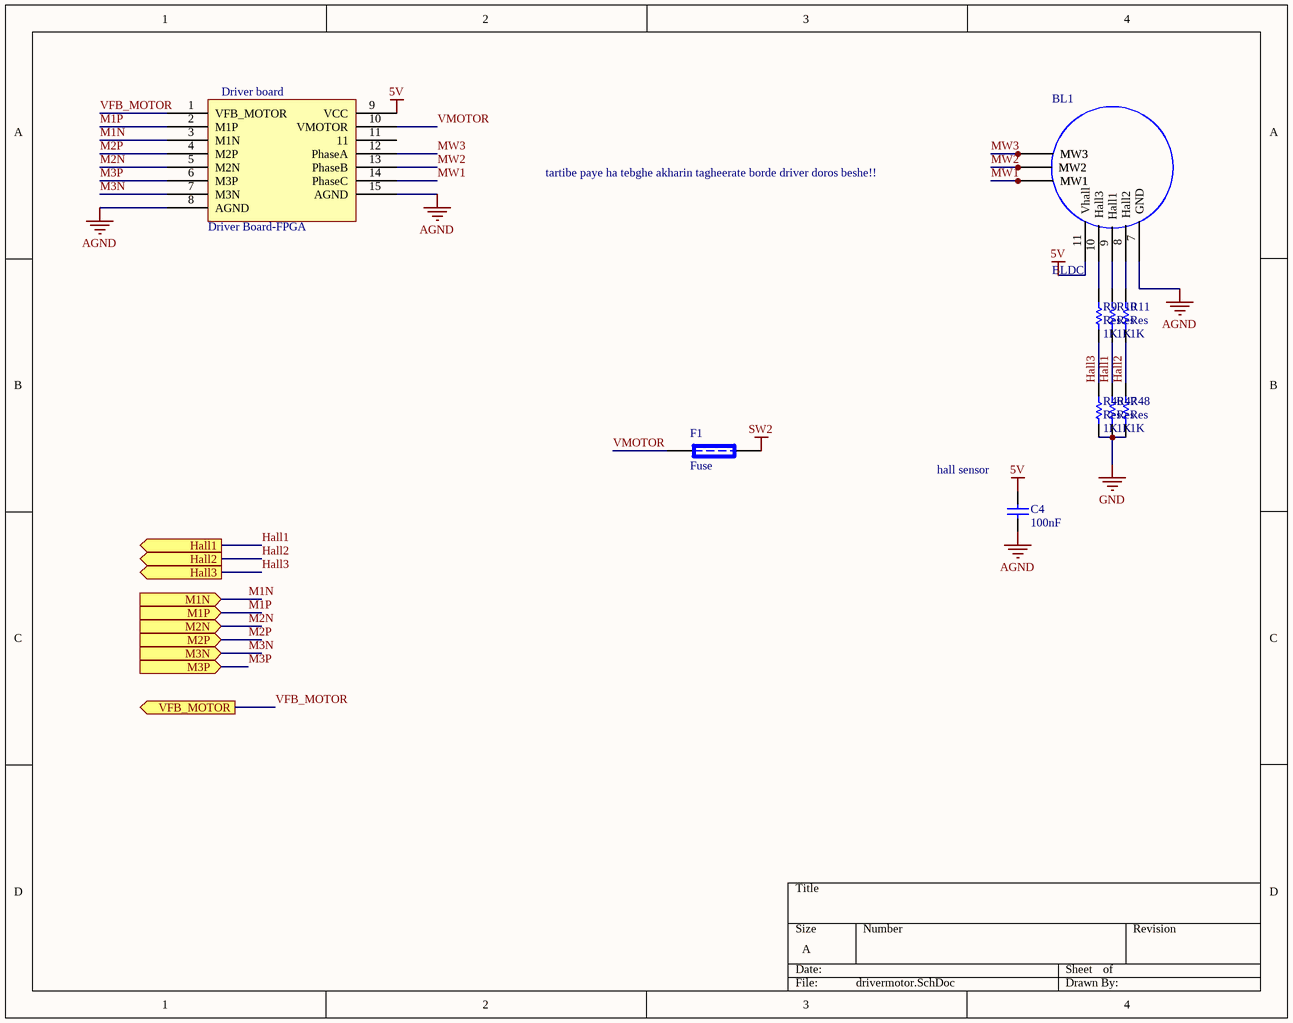
[diagram p5: drivermotor.SchDoc]

### Parts
?  Driver Board-FPGA  [Driver Board-FPGA]
BL1  BLDC  [FLT11]
C4  value 100nF  [2012[0805]]  (hidden comment: Cap_UP)
F1  Fuse  [fuse kh]
R9  Res  value 1K  [2012[0805]]
R10  Res  value 1K  [2012[0805]]
R11  Res  value 1K  [2012[0805]]
R46  Res  value 1K  [2012[0805]]
R47  Res  value 1K  [2012[0805]]
R48  Res  value 1K  [2012[0805]]

### Ports
Hall1 (out), Hall2 (out), Hall3 (out), M1N (in), M1P (in), M2N (in), M2P (in), M3N (in), M3P (in), VFB_MOTOR (out)

### Nets
5V: ?.9(VCC) BL1.11(Vhall) C4.2
AGND: ?.8(AGND) ?.15(AGND) BL1.7(GND) C4.1
GND: R46.1 R47.1 R48.1
SW2: F1.2
Hall1: R10.1 R47.2 ; port Hall1
Hall2: R11.1 R48.2 ; port Hall2
Hall3: R9.1 R46.2 ; port Hall3
M1N: ?.3(M1N) ; port M1N
M1P: ?.2(M1P) ; port M1P
M2N: ?.5(M2N) ; port M2N
M2P: ?.4(M2P) ; port M2P
M3N: ?.7(M3N) ; port M3N
M3P: ?.6(M3P) ; port M3P
MW1: ?.14(PhaseC) BL1.1(MW1) BL1.2(MW1)
MW2: ?.13(PhaseB) BL1.3(MW2) BL1.4(MW2)
MW3: ?.12(PhaseA) BL1.5(MW3) BL1.6(MW3)
VFB_MOTOR: ?.1(VFB_MOTOR) ; port VFB_MOTOR
VMOTOR: ?.10(VMOTOR) F1.1
NetBL1_8: BL1.8(Hall2) R11.2
NetBL1_9: BL1.9(Hall1) R10.2
NetBL1_10: BL1.10(Hall3) R9.2

Not connected (* = marked no-connect by the designer): ? 11

### Channels
drivermotor1: designators end in _drivermotor1; ports Hall1=Hall1_drivermotor1 Hall2=Hall2_drivermotor1 Hall3=Hall3_drivermotor1 M1N=M1N_drivermotor1 M1P=M1P_drivermotor1 M2N=M2N_drivermotor1 M2P=M2P_drivermotor1 M3N=M3N_drivermotor1 M3P=M3P_drivermotor1 VFB_MOTOR=CUR_M1
drivermotor2: designators end in _drivermotor2; ports Hall1=Hall1_drivermotor2 Hall2=Hall2_drivermotor2 Hall3=Hall3_drivermotor2 M1N=M1N_drivermotor2 M1P=M1P_drivermotor2 M2N=M2N_drivermotor2 M2P=M2P_drivermotor2 M3N=M3N_drivermotor2 M3P=M3P_drivermotor2 VFB_MOTOR=CUR_M2
drivermotor3: designators end in _drivermotor3; ports Hall1=Hall1_drivermotor3 Hall2=Hall2_drivermotor3 Hall3=Hall3_drivermotor3 M1N=M1N_drivermotor3 M1P=M1P_drivermotor3 M2N=M2N_drivermotor3 M2P=M2P_drivermotor3 M3N=M3N_drivermotor3 M3P=M3P_drivermotor3 VFB_MOTOR=CUR_M3
drivermotor4: designators end in _drivermotor4; ports Hall1=Hall1_drivermotor4 Hall2=Hall2_drivermotor4 Hall3=Hall3_drivermotor4 M1N=M1N_drivermotor4 M1P=M1P_drivermotor4 M2N=M2N_drivermotor4 M2P=M2P_drivermotor4 M3N=M3N_drivermotor4 M3P=M3P_drivermotor4 VFB_MOTOR=CUR_M4

### Notes on the sheet
- tartibe paye ha tebghe akharin tagheerate borde driver doros beshe!!
- (near C4) hall sensor
- (in symbol Driver Board-FPGA) Driver board

### Library data of the parts
C4 = Cap_UP: Capacitor; Published: 8-Jun-2000; LatestRevisionDate: 17-Jul-2002; LatestRevisionNote: Re-released for DXP Platform.; PackageReference: RAD-0.3; Publisher: Altium Limited
R9-R11 R46-R48 = Res: Semiconductor Resistor; Published: 8-Jun-2000; LatestRevisionDate: 17-Jul-2002; LatestRevisionNote: Re-released for DXP Platform.; PackageReference: AXIAL-0.5; Publisher: Altium Limited
F1 = Fuse: Published: 8-Jun-2000; LatestRevisionDate: 17-Jul-2002; LatestRevisionNote: Re-released for DXP Platform.; PackageReference: PIN-W2/E2.8; Publisher: Altium Limited

## Nets that join several sheets
3.3V: atxmega64 (21 pins), power (6 pins), IR (R14.1 R15.1 VR1.2 VR1.3), sensor10DOF-S (7 pins)
5V: power (23 pins), drivermotor1 (_drivermotor1.9 BL1_drivermotor1.11 C4_drivermotor1.2), drivermotor2 (_drivermotor2.9 BL1_drivermotor2.11 C4_drivermotor2.2), drivermotor3 (_drivermotor3.9 BL1_drivermotor3.11 C4_drivermotor3.2), drivermotor4 (_drivermotor4.9 BL1_drivermotor4.11 C4_drivermotor4.2)
AGND: power (39 pins), drivermotor1 (_drivermotor1.8 _drivermotor1.15 BL1_drivermotor1.7 C4_drivermotor1.1), drivermotor2 (_drivermotor2.8 _drivermotor2.15 BL1_drivermotor2.7 C4_drivermotor2.1), drivermotor3 (_drivermotor3.8 _drivermotor3.15 BL1_drivermotor3.7 C4_drivermotor3.1), drivermotor4 (_drivermotor4.8 _drivermotor4.15 BL1_drivermotor4.7 C4_drivermotor4.1)
GND: atxmega64 (28 pins), power (FB?.1), IR (IR.1 Q2.3), sensor10DOF-S (8 pins), drivermotor1 (R46_drivermotor1.1 R47_drivermotor1.1 R48_drivermotor1.1), drivermotor2 (R46_drivermotor2.1 R47_drivermotor2.1 R48_drivermotor2.1), drivermotor3 (R46_drivermotor3.1 R47_drivermotor3.1 R48_drivermotor3.1), drivermotor4 (R46_drivermotor4.1 R47_drivermotor4.1 R48_drivermotor4.1)
SW2: power (R19.2 S4.1 U10.1 U10.2), drivermotor1 (F1_drivermotor1.2), drivermotor2 (F1_drivermotor2.2), drivermotor3 (F1_drivermotor3.2), drivermotor4 (F1_drivermotor4.2)
CUR_KICK: atxmega64 (R39.2), power (U10.7)
CUR_M1: atxmega64 (R35.2), drivermotor1 (_drivermotor1.1)
CUR_M2: atxmega64 (R41.2), drivermotor2 (_drivermotor2.1)
CUR_M3: atxmega64 (R37.2), drivermotor3 (_drivermotor3.1)
CUR_M4: atxmega64 (R43.2), drivermotor4 (_drivermotor4.1)
CUR_MAIN: atxmega64 (R44.2), power (U8.7)
IR1: atxmega64 (U2.27), IR (Q2.1 R14.2)
SEN-SCL: atxmega64 (U2.17), sensor10DOF-S (MPU6050.23 R24.2)
SEN-SDA: atxmega64 (U2.16), sensor10DOF-S (MPU6050.24 R25.2)
SW-Cap: atxmega64 (U2.64), power (C27.1 R20.2 R21.2 S5.1)
VFB_BATTERY: atxmega64 (U2.1), power (R22.1 R23.2)